# EAGLE design single_digit (EAGLE 5.11)
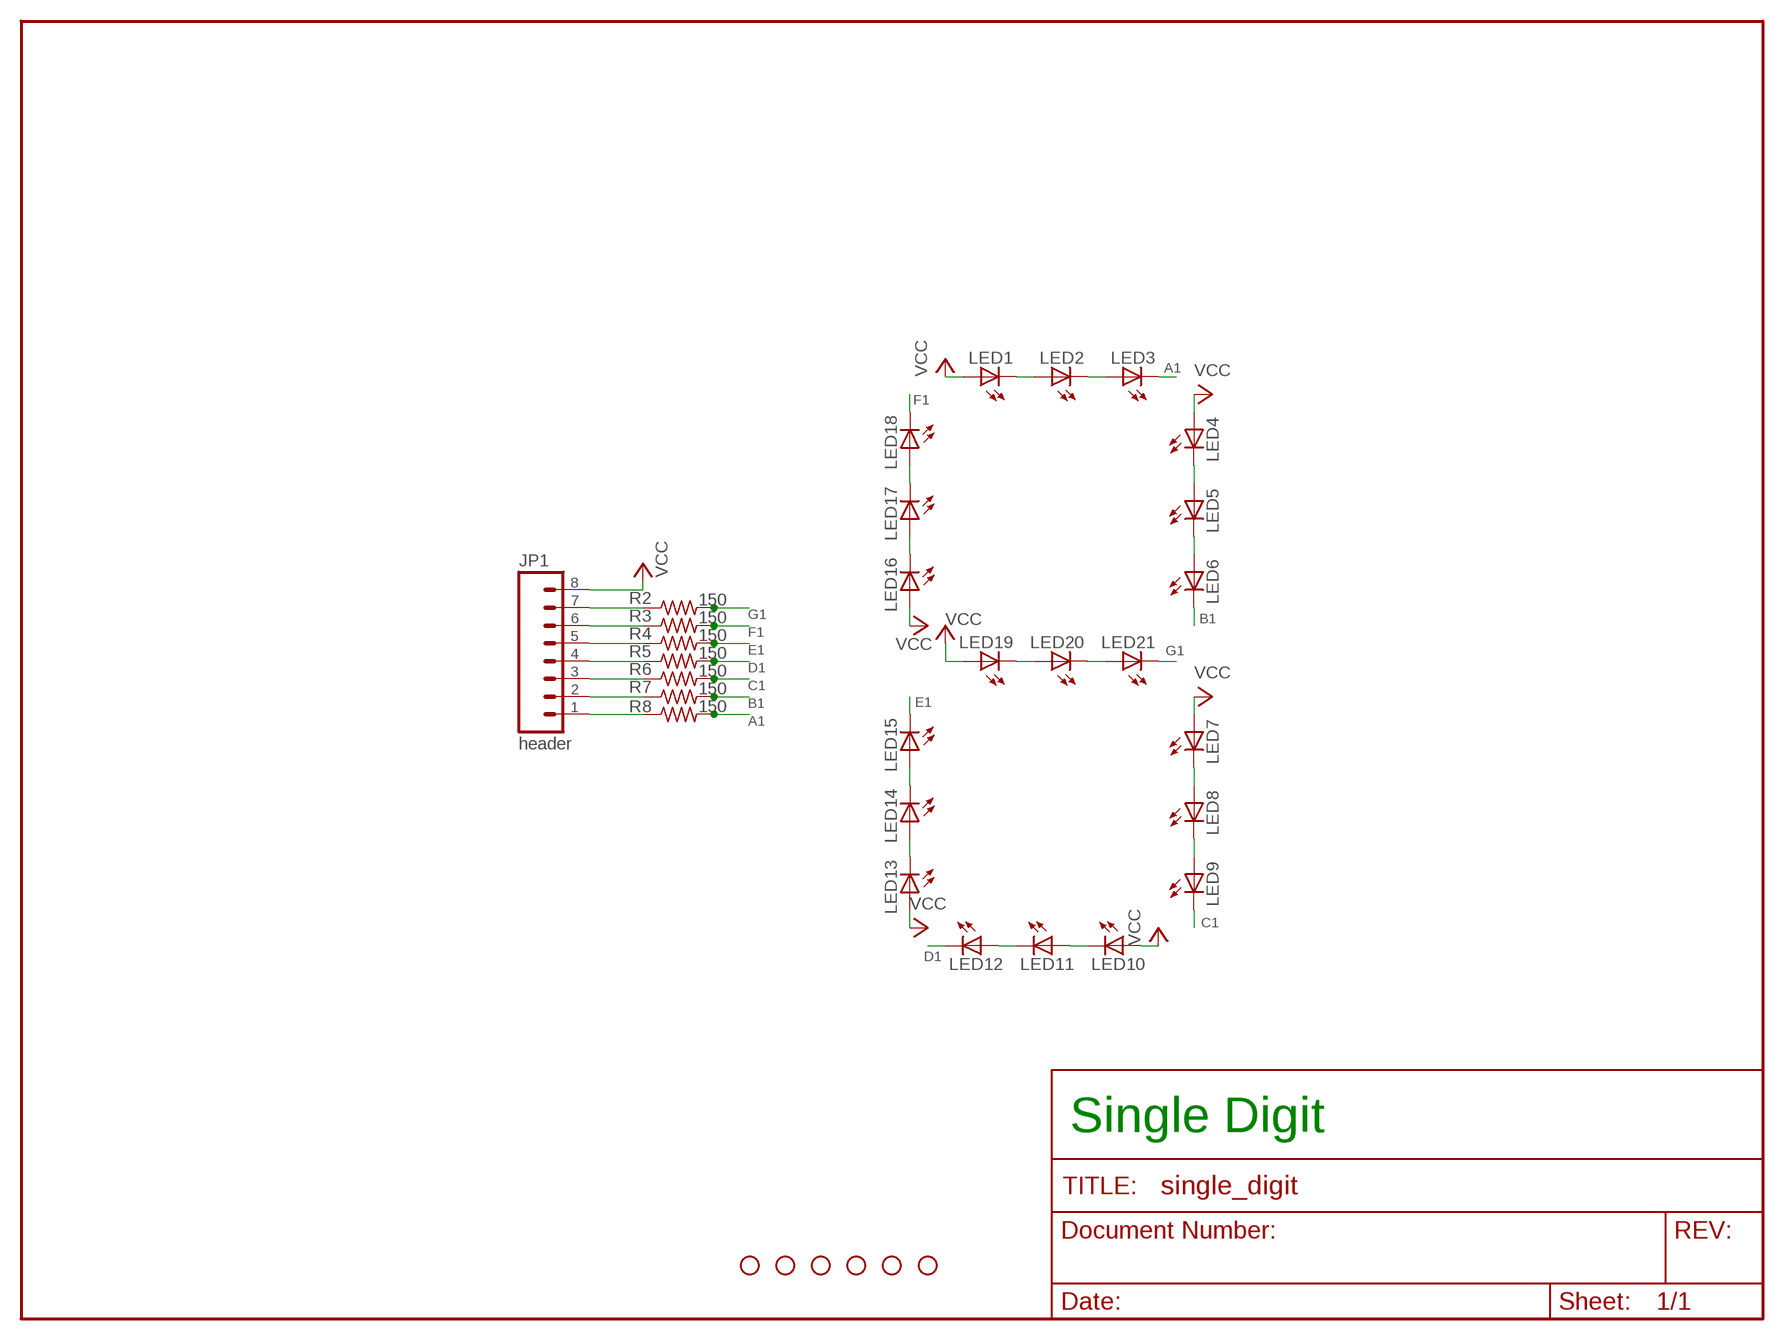
[diagram p0: schematic, sheet 1]

## Parts
JP1  header  M08  [1X08]
JP2  STAND-OFF  [STAND-OFF]
JP3  STAND-OFF  [STAND-OFF]
JP4  STAND-OFF  [STAND-OFF]
JP5  STAND-OFF  [STAND-OFF]
JP6  STAND-OFF  [STAND-OFF]
JP7  STAND-OFF  [STAND-OFF]
LED1  LED5MM  [LED5MM]
LED2  LED5MM  [LED5MM]
LED3  LED5MM  [LED5MM]
LED4  LED5MM  [LED5MM]
LED5  LED5MM  [LED5MM]
LED6  LED5MM  [LED5MM]
LED7  LED5MM  [LED5MM]
LED8  LED5MM  [LED5MM]
LED9  LED5MM  [LED5MM]
LED10  LED5MM  [LED5MM]
LED11  LED5MM  [LED5MM]
LED12  LED5MM  [LED5MM]
LED13  LED5MM  [LED5MM]
LED14  LED5MM  [LED5MM]
LED15  LED5MM  [LED5MM]
LED16  LED5MM  [LED5MM]
LED17  LED5MM  [LED5MM]
LED18  LED5MM  [LED5MM]
LED19  LED5MM  [LED5MM]
LED20  LED5MM  [LED5MM]
LED21  LED5MM  [LED5MM]
R2  150  R-US_0207/2V  [0207/2V]
R3  150  R-US_0207/2V  [0207/2V]
R4  150  R-US_0207/2V  [0207/2V]
R5  150  R-US_0207/2V  [0207/2V]
R6  150  R-US_0207/2V  [0207/2V]
R7  150  R-US_0207/2V  [0207/2V]
R8  150  R-US_0207/2V  [0207/2V]

## Nets
A1 [power]: LED3.K(C) R8.2
B1 [power]: LED6.K(C) R7.2
C1 [power]: LED9.K(C) R6.2
D1 [power]: LED12.K(C) R5.2
E1 [power]: LED15.K(C) R4.2
F1: LED18.K(C) R3.2
G1 [power]: LED21.K(C) R2.2
N$20: JP1.7 R2.1
N$21 [power]: LED1.K(C) LED2.A
N$22 [power]: LED2.K(C) LED3.A
N$23: JP1.6 R3.1
N$24 [power]: LED4.K(C) LED5.A
N$25 [power]: LED5.K(C) LED6.A
N$26: JP1.5 R4.1
N$27 [power]: LED16.K(C) LED17.A
N$28 [power]: LED17.K(C) LED18.A
N$29: JP1.4 R5.1
N$30 [power]: LED19.K(C) LED20.A
N$31 [power]: LED20.K(C) LED21.A
N$32: JP1.3 R6.1
N$33 [power]: LED7.K(C) LED8.A
N$34 [power]: LED8.K(C) LED9.A
N$35: JP1.2 R7.1
N$36 [power]: LED10.K(C) LED11.A
N$37 [power]: LED11.K(C) LED12.A
N$38: JP1.1 R8.1
N$39 [power]: LED13.K(C) LED14.A
N$40 [power]: LED14.K(C) LED15.A
VCC [power]: JP1.8 LED1.A LED4.A LED7.A LED10.A LED13.A LED16.A LED19.A

## Notes on the sheet
- Single Digit

## Library data of the parts
JP1 = SparkFun:M08: Header 8 Standard 8-pin 0.1" header. Use with straight break away headers (SKU : PRT-00116), right angle break away headers (PRT-00553), swiss pins (PRT-00743), machine pins (PRT-00117), and female headers (PRT-00115).
JP2-JP7 = SparkFun:STAND-OFF: Stand Off This is the mechanical footprint for a #4 phillips button head screw. Use the keepout ring to avoid running the screw head into surrounding components. SKU : PRT-00447
LED1-LED21 = SparkFun:LED: LEDs Standard schematic elements and footprints for 5mm, 3mm, 1206, and 0603 sized LEDs. 5mm - Spark Fun Electronics SKU : COM-00529 (and others)
R2-R8 = rcl:R-US_: RESISTOR, American symbol

## Net classes
1 power: width 0.406 mm, clearance 0.305 mm

## Board
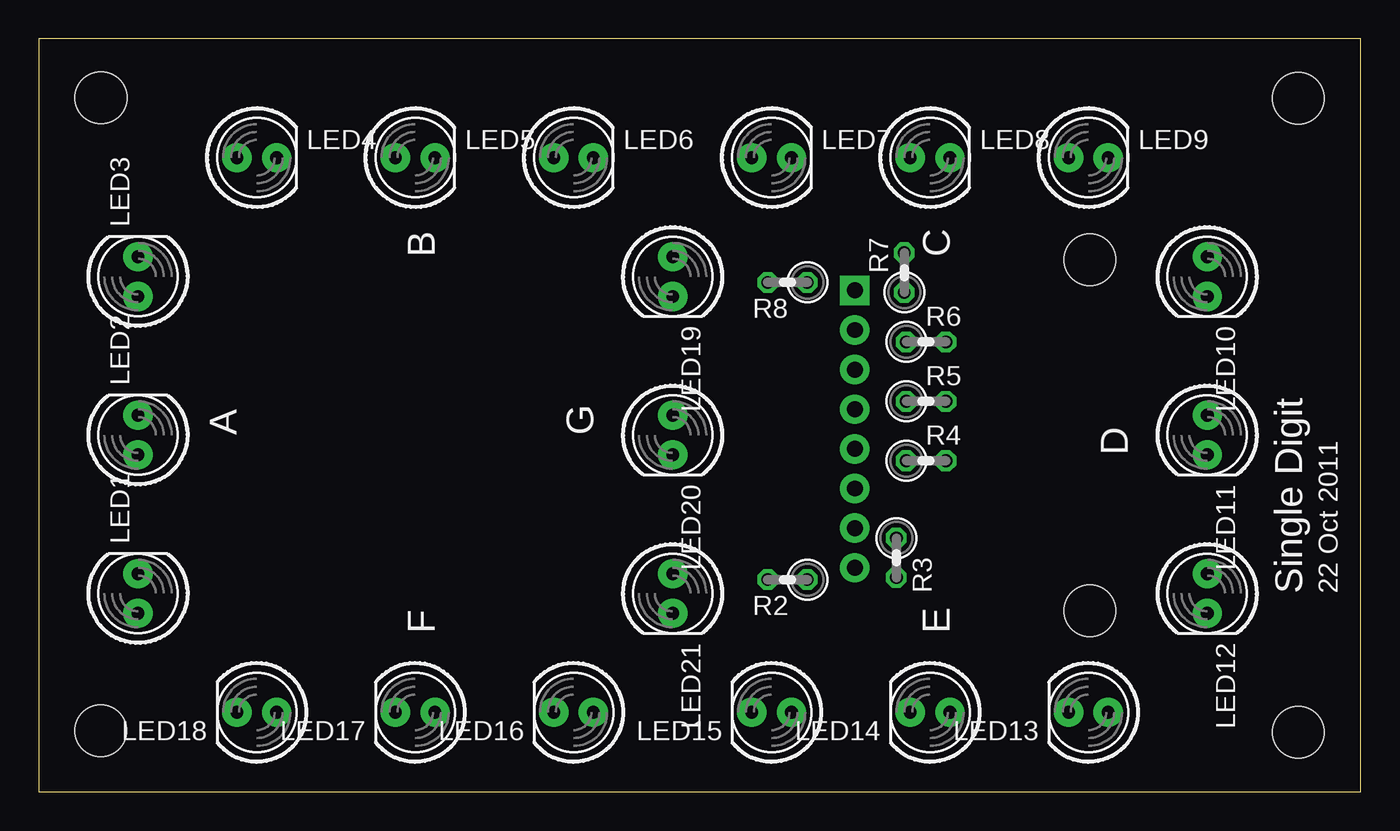
[diagram p1: board, top side]
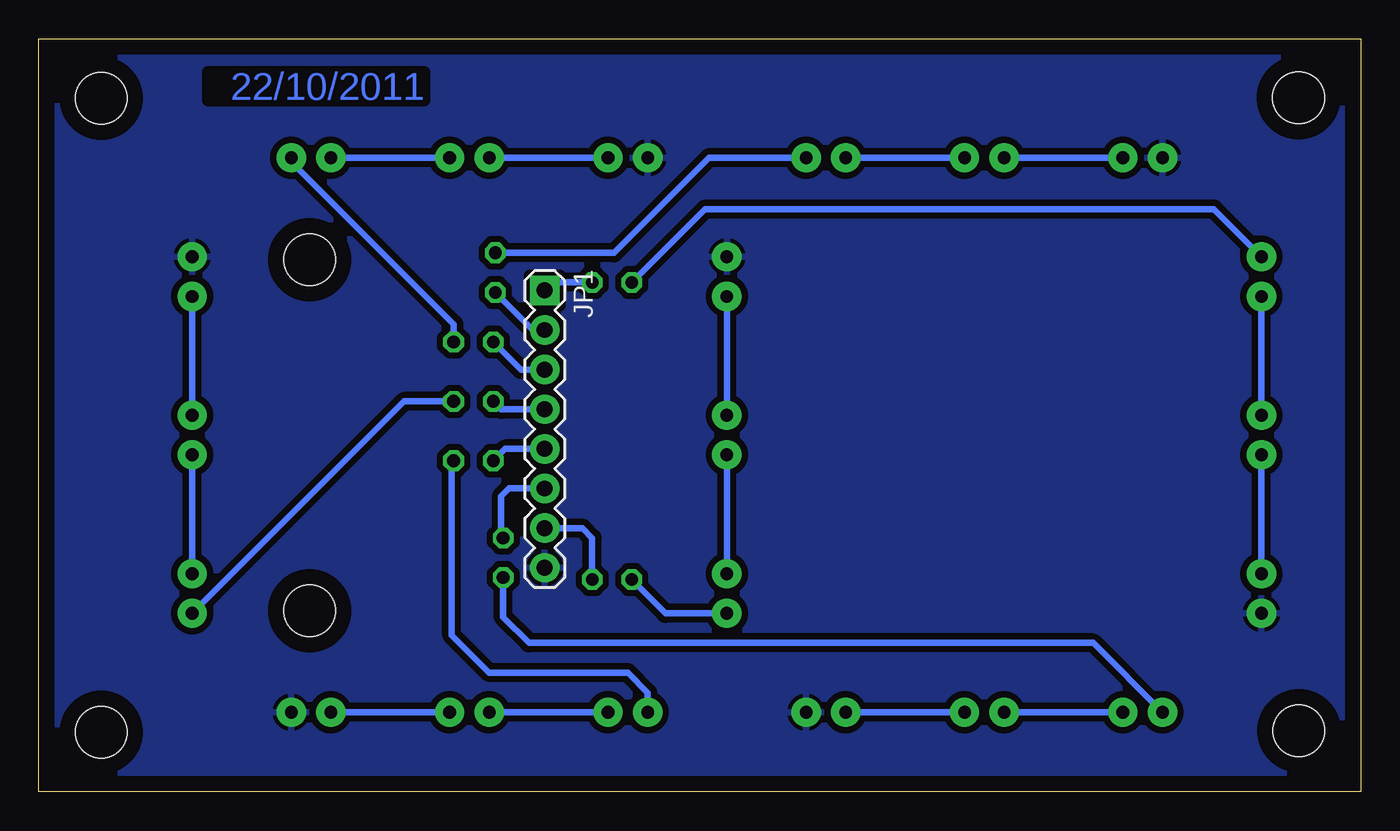
[diagram p2: board, bottom side, seen from below]

Size 84.76 x 48.25 mm. Coordinates in mm from the lower left corner, seen from the top.
Outline: 0,0 84.76,0 84.76,48.25 0,48.25 0,0
Copper layers (1*16): Top 0.035mm / dielectric 1.5mm / Bottom 0.035mm
Design rules "default": minimum track width 10mil, minimum drill 24mil, track to track 8mil, track to pad 8mil, pad to pad 8mil, via to via 8mil, smd to smd 8mil, copper to edge 40mil, drill to drill 8mil, minimum pad ring 10mil, minimum via ring 8mil, stop-mask expansion 4mil, vias tented up to drill 0mil, thermal gap 10mil

### Footprints (pad centres in the part's own frame; a part is rotated, then mirrored left to right if it is on the bottom)
1X08 = drill 1.016 pad 1.88 square: 1 0,0 | drill 1.016 pad 1.88 round: 2 2.54,0; 3 5.08,0; 4 7.62,0; 5 10.16,0; 6 12.7,0; 7 15.24,0; 8 17.78,0
STAND-OFF = hole 3.302: 0,0
LED5MM = drill 0.813 pad 1.88 round: A -1.27,0; K 1.27,0
0207/2V = drill 0.813 octagon: 1 -1.27,0; 2 1.27,0

### Placement (x,y rotation side)
JP1  52.32,32.13 270 bottom
JP2  67.4,11.6 0 top
JP3  67.4,34.1 0 top
JP4  3.95,3.9 0 top
JP5  3.97,44.48 0 top
JP6  80.77,3.81 0 top
JP7  80.77,44.45 0 top
LED1  6.35,12.7 90 top
LED2  6.35,22.86 90 top
LED3  6.35,33.02 90 top
LED4  13.97,40.64 0 top
LED5  24.13,40.64 0 top
LED6  34.29,40.64 0 top
LED7  46.99,40.64 0 top
LED8  57.15,40.64 0 top
LED9  67.31,40.64 0 top
LED10  74.93,33.02 270 top
LED11  74.93,22.86 270 top
LED12  74.93,12.7 270 top
LED13  67.31,5.08 180 top
LED14  57.15,5.08 180 top
LED15  46.99,5.08 180 top
LED16  34.29,5.08 180 top
LED17  24.13,5.08 180 top
LED18  13.97,5.08 180 top
LED19  40.64,33.02 270 top
LED20  40.64,22.86 270 top
LED21  40.64,12.7 270 top
R2  48.01,13.59 180 top
R3  54.99,14.99 270 top
R4  56.9,21.21 0 top
R5  56.9,25.02 0 top
R6  56.9,28.83 0 top
R7  55.5,33.27 90 top
R8  48.01,32.64 180 top

### Tracks (layer width: path | path; a pad name or v marks a point on that pad's centre or on a via)
A1
  Bottom 0.406: R8.2 42.04,37.34 9.4,37.34 LED3.K
B1
  Bottom 0.406: LED6.K 41.78,40.64 47.88,34.54 R7.2
C1
  Bottom 0.406: R6.2 58.17,29.97 68.58,40.39 LED9.K
D1
  Bottom 0.406: R5.2 61.34,25.02 LED12.K
E1
  Bottom 0.406: LED15.K 45.72,6.35 46.99,7.62 55.88,7.62 58.29,10.03 58.29,21.08 R4.2
F1
  Bottom 0.406: R3.2 54.99,11.18 53.34,9.53 17.14,9.53 LED18.K
G1
  Bottom 0.406: LED21.K 44.58,11.43 R2.2
N$20
  Bottom 0.406: JP1.7 49.91,16.89 49.28,16.26 R2.1
N$21
  Bottom 0.406: LED1.K LED2.A
N$22
  Bottom 0.406: LED2.K LED3.A
N$23
  Bottom 0.406: JP1.6 54.61,19.43 55.12,18.92 55.12,16.38 R3.1
N$24
  Bottom 0.406: LED4.K LED5.A
N$25
  Bottom 0.406: LED5.K LED6.A
N$26
  Bottom 0.406: JP1.5 54.86,21.97 R4.1
N$27
  Bottom 0.406: LED17.A LED16.K
N$28
  Bottom 0.406: LED18.A LED17.K
N$29
  Bottom 0.406: JP1.4 55.12,24.51 R5.1
N$30
  Bottom 0.406: LED20.A LED19.K
N$31
  Bottom 0.406: LED21.A LED20.K
N$32
  Bottom 0.406: JP1.3 53.85,27.05 R6.1
N$33
  Bottom 0.406: LED7.K LED8.A
N$34
  Bottom 0.406: LED8.K LED9.A
N$35
  Bottom 0.406: JP1.2 53.09,29.59 R7.1
N$36
  Bottom 0.406: LED11.A LED10.K
N$37
  Bottom 0.406: LED12.A LED11.K
N$38
  Bottom 0.406: R8.1 51.82,32.64 JP1.1
N$39
  Bottom 0.406: LED14.A LED13.K
N$40
  Bottom 0.406: LED15.A LED14.K
VCC
  pour Bottom (isolate 0.406): -6.35,60.96 101.6,60.96 101.6,-11.43 -6.35,-11.43

### Text on the board
Bottom: 22/10/2011
tPlace: B | C | A | G | D | Single Digit | 22 Oct 2011 | F | E